# EAGLE design ROM Board 2 (EAGLE 6.6.0)
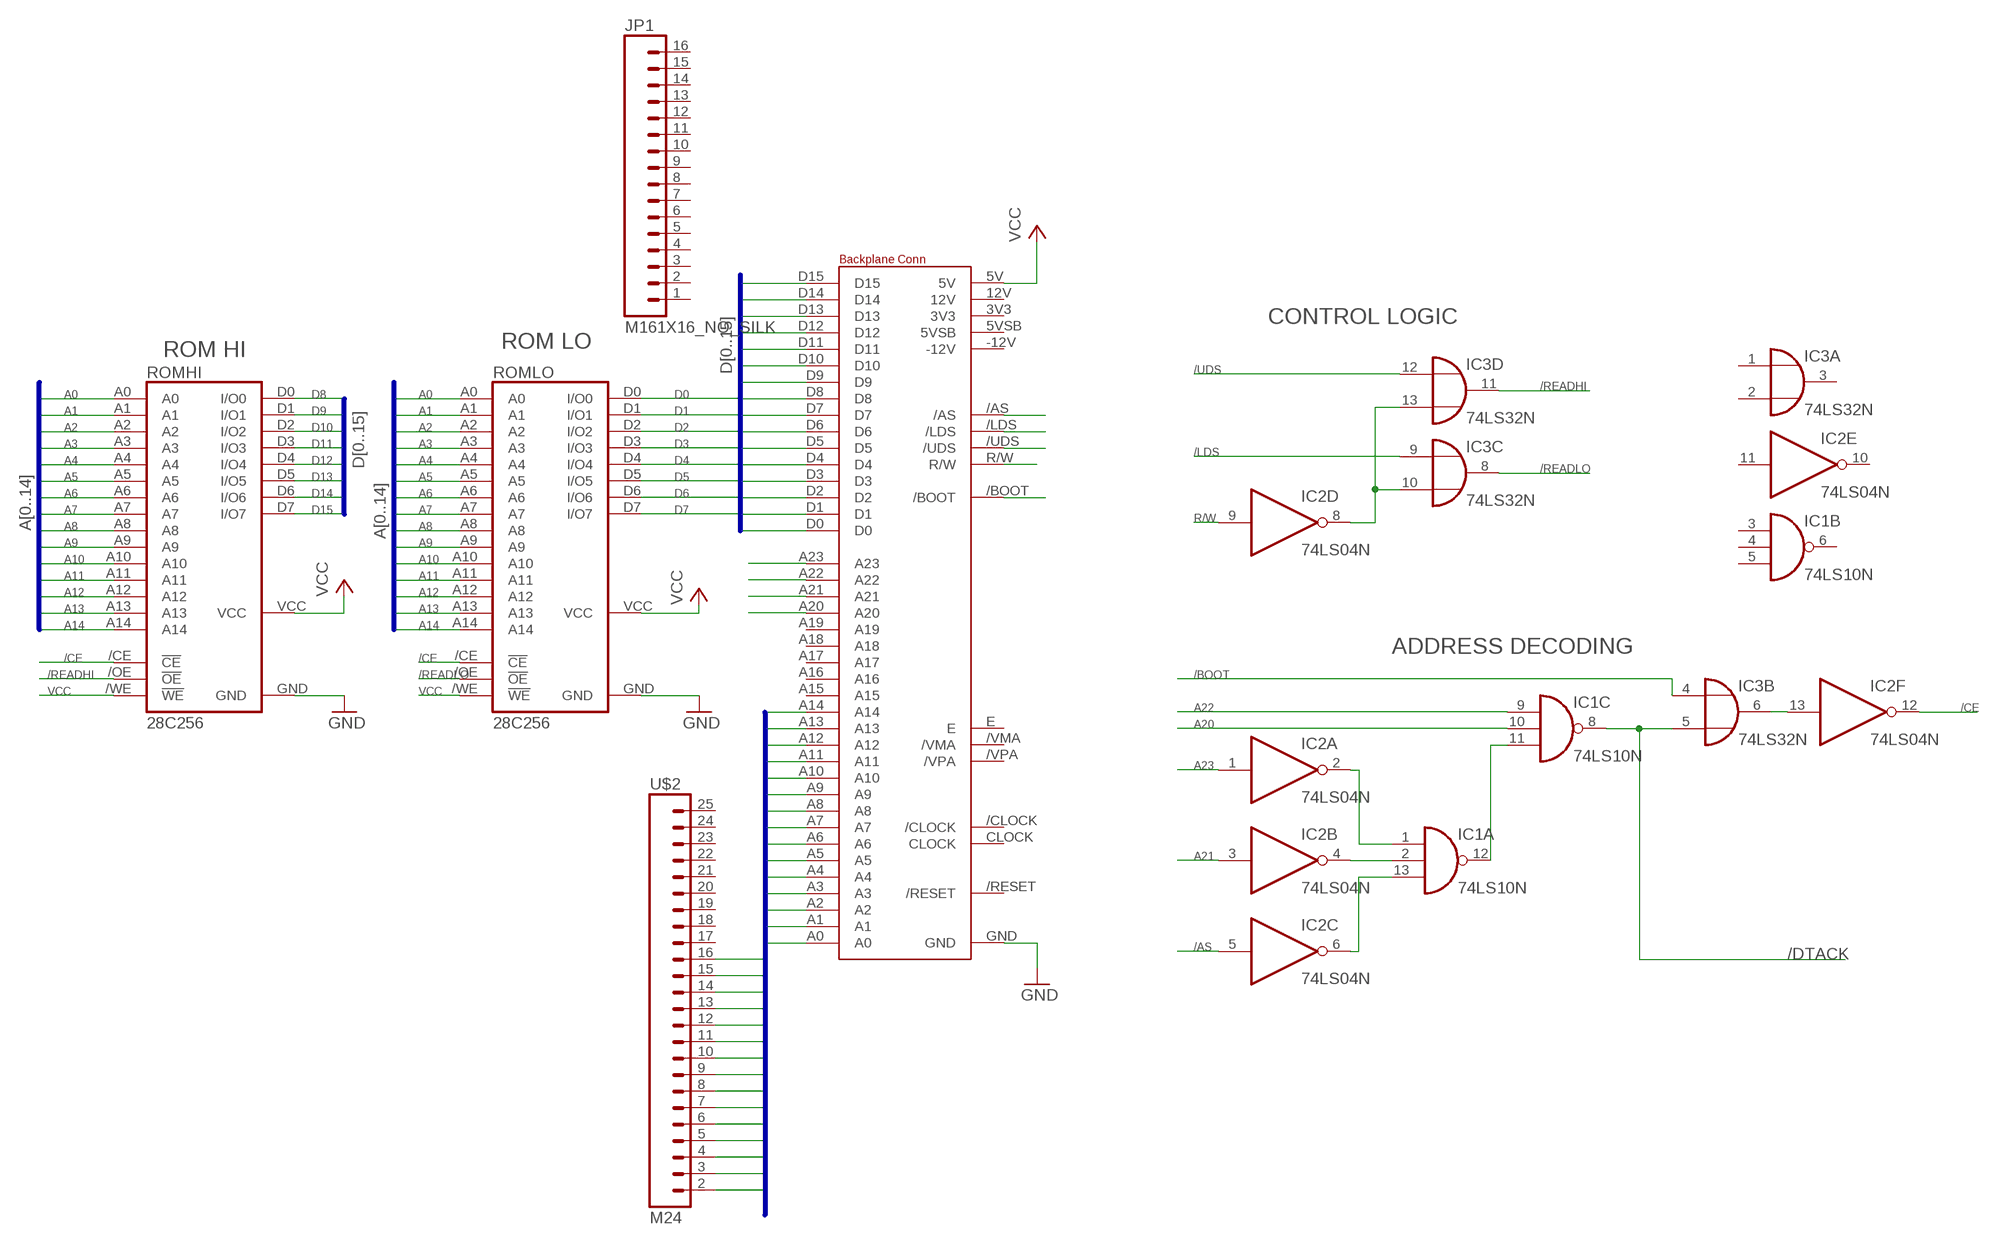
[diagram p0: schematic, sheet 1]

## Parts
IC1  74LS10N  [DIL14]
IC2  74LS04N  [DIL14]
IC3  74LS32N  [DIL14]
JP1  M161X16_NO_SILK  [1X16_NO_SILK]
ROMHI  28C256  [DIL28-6]
ROMLO  28C256  [DIL28-6]
U$1  BACKPLANECONN  [BLANKBOARD]
U$2  M24  [1X24]

## Nets
/AS: IC2.5(C:I) U$1./AS
/BOOT: IC3.4(B:I0) U$1./BOOT
/CE: IC2.12(F:O) ROMHI./CE(!CE) ROMLO./CE(!CE)
/LDS: IC3.9(C:I0) U$1./LDS
/READHI: IC3.11(D:O) ROMHI./OE(!OE)
/READLO: IC3.8(C:O) ROMLO./OE(!OE)
/UDS: IC3.12(D:I0) U$1./UDS
A0: ROMHI.A0 ROMLO.A0 U$1.A0 U$2.2
A1: ROMHI.A1 ROMLO.A1 U$1.A1 U$2.3
A2: ROMHI.A2 ROMLO.A2 U$1.A2 U$2.4
A3: ROMHI.A3 ROMLO.A3 U$1.A3 U$2.5
A4: ROMHI.A4 ROMLO.A4 U$1.A4 U$2.6
A5: ROMHI.A5 ROMLO.A5 U$1.A5 U$2.7
A6: ROMHI.A6 ROMLO.A6 U$1.A6 U$2.8
A7: ROMHI.A7 ROMLO.A7 U$1.A7 U$2.9
A8: ROMHI.A8 ROMLO.A8 U$1.A8 U$2.10
A9: ROMHI.A9 ROMLO.A9 U$1.A9 U$2.11
A10: ROMHI.A10 ROMLO.A10 U$1.A10 U$2.12
A11: ROMHI.A11 ROMLO.A11 U$1.A11 U$2.13
A12: ROMHI.A12 ROMLO.A12 U$1.A12 U$2.14
A13: ROMHI.A13 ROMLO.A13 U$1.A13 U$2.15
A14: ROMHI.A14 ROMLO.A14 U$1.A14 U$2.16
A20: IC1.10(C:I1) U$1.A20
A21: IC2.3(B:I) U$1.A21
A22: IC1.9(C:I0) U$1.A22
A23: IC2.1(A:I) U$1.A23
D0: ROMLO.D0(I/O0) U$1.D0
D1: ROMLO.D1(I/O1) U$1.D1
D2: ROMLO.D2(I/O2) U$1.D2
D3: ROMLO.D3(I/O3) U$1.D3
D4: ROMLO.D4(I/O4) U$1.D4
D5: ROMLO.D5(I/O5) U$1.D5
D6: ROMLO.D6(I/O6) U$1.D6
D7: ROMLO.D7(I/O7) U$1.D7
D8: ROMHI.D0(I/O0) U$1.D8
D9: ROMHI.D1(I/O1) U$1.D9
D10: ROMHI.D2(I/O2) U$1.D10
D11: ROMHI.D3(I/O3) U$1.D11
D12: ROMHI.D4(I/O4) U$1.D12
D13: ROMHI.D5(I/O5) U$1.D13
D14: ROMHI.D6(I/O6) U$1.D14
D15: ROMHI.D7(I/O7) U$1.D15
DECODEOUT: IC1.8(C:O) IC3.5(B:I1)
GND: ROMHI.GND ROMLO.GND U$1.GND
N$1: IC1.1(A:I0) IC2.2(A:O)
N$2: IC1.2(A:I1) IC2.4(B:O)
N$3: IC1.13(A:I2) IC2.6(C:O)
N$4: IC1.11(C:I2) IC1.12(A:O)
N$5: IC2.13(F:I) IC3.6(B:O)
N$6: IC2.8(D:O) IC3.10(C:I1) IC3.13(D:I1)
R/W: IC2.9(D:I) U$1.R/W
VCC: ROMHI./WE(!WE) ROMHI.VCC ROMLO./WE(!WE) ROMLO.VCC U$1.5V
Unconnected: IC1.3(B:I0) IC1.4(B:I1) IC1.5(B:I2) IC1.6(B:O) IC2.10(E:O) IC2.11(E:I) IC3.1(A:I0) IC3.2(A:I1) IC3.3(A:O) JP1.1 JP1.2 JP1.3 JP1.4 JP1.5 JP1.6 JP1.7 JP1.8 JP1.9 JP1.10 JP1.11 JP1.12 JP1.13 JP1.14 JP1.15 JP1.16 U$1.3V3 U$1.5VSB U$1.12V U$1.-12V U$1./CLOCK U$1./RESET U$1./VMA U$1./VPA U$1.A15 U$1.A16 U$1.A17 U$1.A18 U$1.A19 U$1.CLOCK U$1.E U$2.17 U$2.18 U$2.19 U$2.20 U$2.21 U$2.22 U$2.23 U$2.24 U$2.25

## Buses
A[0..14]
D[0..15]

## Notes on the sheet
- CONTROL LOGIC
- ROM LO
- ROM HI
- ADDRESS DECODING
- /DTACK

## Power pins joined to a net without a drawn wire
GND: IC1.7(P:GND) IC2.7(P:GND) IC3.7(P:GND)
VCC: IC1.14(P:VCC) IC2.14(P:VCC) IC3.14(P:VCC)

## Library data of the parts
IC1 = 74xx-eu:74*10: Triple 3-input NAND gate
IC2 = 74xx-eu:74*04: Hex INVERTER
IC3 = 74xx-eu:74*32: Quad 2-input OR gate
JP1 = SparkFun-Connectors:M16: 1x16 .1" header
ROMHI ROMLO = memory-nec:28C256: 28C256 32k x 8 parallel EEPROM
U$1 = Benchoff2:BACKPLANECONN: Backplane Connector
U$2 = SparkFun-Connectors:M24: 1x24 .1" header

## Board
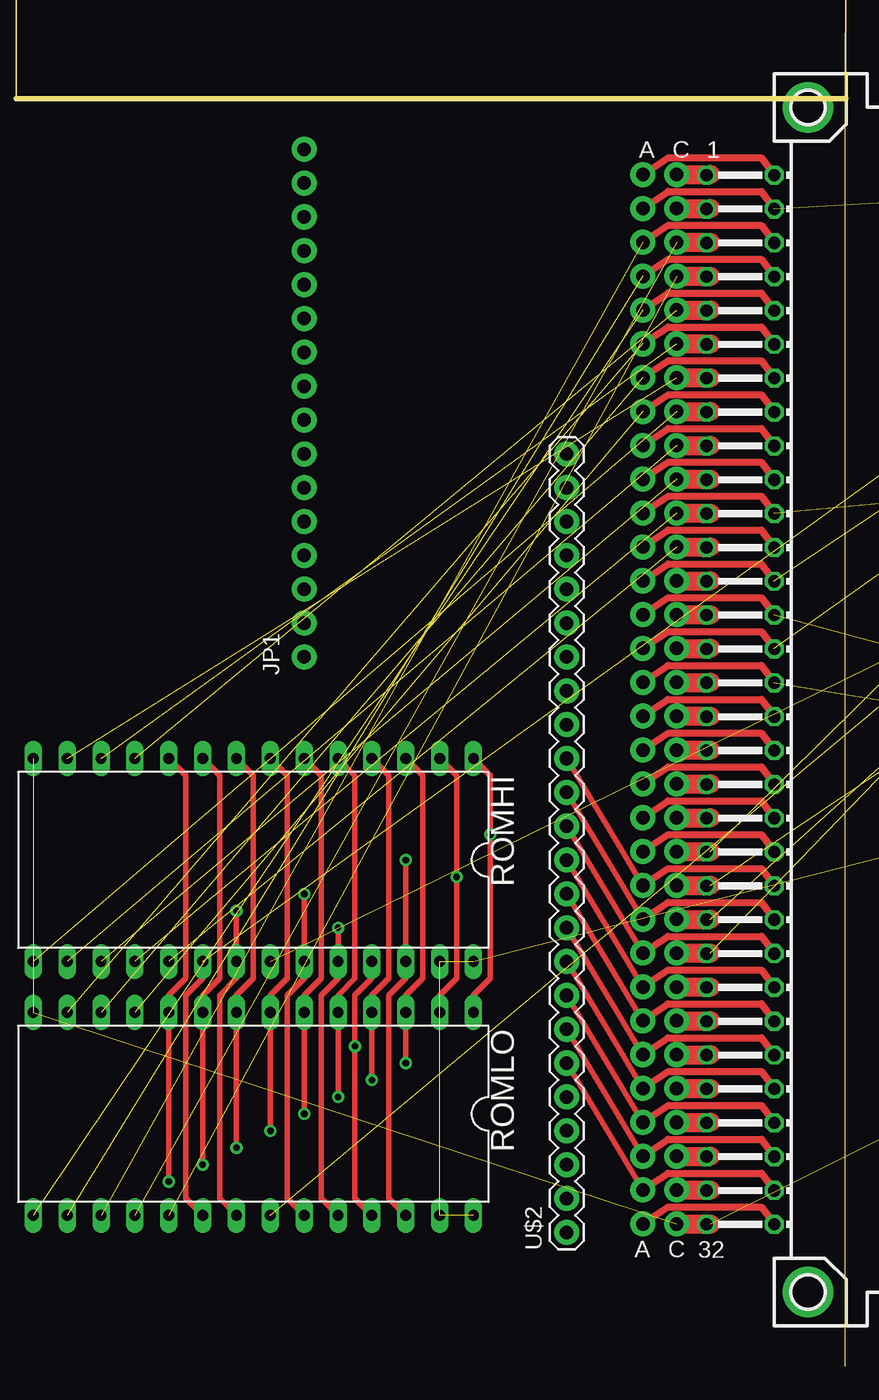
[diagram p1: board, top side]
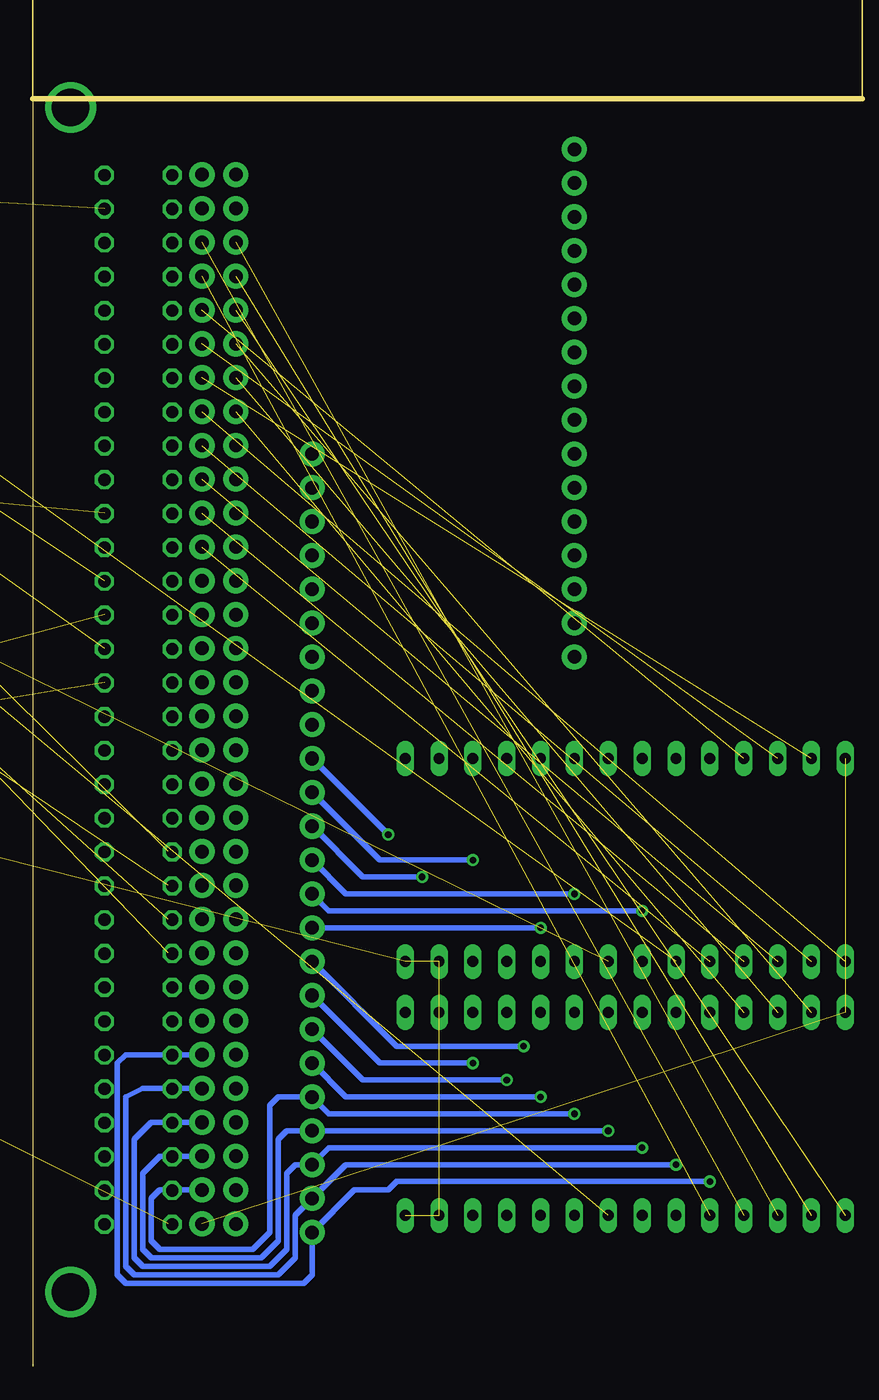
[diagram p2: board, bottom side, seen from below]

Size 0 x 100.03 mm. Coordinates in mm from the lower left corner, seen from the top.
Copper layers (1*16): Top 0.035mm / dielectric 1.5mm / Bottom 0.035mm
Design rules "default": minimum track width 10mil, minimum drill 24mil, track to track 8mil, track to pad 8mil, pad to pad 8mil, via to via 8mil, smd to smd 8mil, copper to edge 40mil, drill to drill 8mil, minimum pad ring 10mil, minimum via ring 8mil, stop-mask expansion 4mil, vias tented up to drill 0mil, thermal gap 10mil
tRestrict: area -86.3,142.1 to -78.7,147.2; area -86.3,154.8 to -78.7,159.9; area -69.8,144.7 to -59.6,157.4; area -52,144.7 to -41.9,157.4; area -34.2,144.7 to -24.1,157.4; area -104.1,142.1 to -96.5,147.2
Milling: area -62.2,103.7 to -60.7,104.3; area -1.5,103.7 to 0,104.3; area -34.5,104.4 to -27.6,106.2; 4 lines

### Footprints (pad centres in the part's own frame; a part is rotated, then mirrored left to right if it is on the bottom)
DIL14 = drill 0.813 long: 1 -7.62,-3.81; 2 -5.08,-3.81; 3 -2.54,-3.81; 4 0,-3.81; 5 2.54,-3.81; 6 5.08,-3.81; 7 7.62,-3.81; 8 7.62,3.81; 9 5.08,3.81; 10 2.54,3.81; 11 0,3.81; 12 -2.54,3.81; 13 -5.08,3.81; 14 -7.62,3.81
1X16_NO_SILK = drill 1.016 pad 1.88: 1 0,0; 2 2.54,0; 3 5.08,0; 4 7.62,0; 5 10.16,0; 6 12.7,0; 7 15.24,0; 8 17.78,0; 9 20.32,0; 10 22.86,0; 11 25.4,0; 12 27.94,0; 13 30.48,0; 14 33.02,0; 15 35.56,0; 16 38.1,0
DIL28-6 = drill 0.813 long: /CE 3.81,7.62; /OE -1.27,7.62; /WE -13.97,7.62; A0 6.35,-7.62; A1 3.81,-7.62; A2 1.27,-7.62; A3 -1.27,-7.62; A4 -3.81,-7.62; A5 -6.35,-7.62; A6 -8.89,-7.62; A7 -11.43,-7.62; A8 -8.89,7.62; A9 -6.35,7.62; A10 1.27,7.62; A11 -3.81,7.62; A12 -13.97,-7.62; A13 -11.43,7.62; A14 -16.51,-7.62; D0 8.89,-7.62; D1 11.43,-7.62; D2 13.97,-7.62; D3 16.51,7.62; D4 13.97,7.62; D5 11.43,7.62; D6 8.89,7.62; D7 6.35,7.62; GND 16.51,-7.62; VCC -16.51,7.62
BLANKBOARD = drill 1.016 pad 1.88: 3V3 -13.97,37.465; 5V -16.51,34.925; 5VSB -13.97,34.925; 12V -16.51,37.465; 26 -13.97,6.985; 28 -13.97,4.445; 30 -13.97,1.905; 32 -13.97,-0.635; 34 -13.97,-3.175; 36 -13.97,-5.715; 40 -13.97,-10.795; -12V -16.51,-41.275; /AS -13.97,-20.955; /BOOT -16.51,12.065; /CLOCK -13.97,-26.035; /LDS -13.97,-18.415; /RESET -13.97,-8.255; /UDS -13.97,-15.875; /VMA -16.51,14.605; /VPA -16.51,9.525; A0 -13.97,-28.575; A1 -13.97,-31.115; A2 -13.97,-33.655; A3 -13.97,-36.195; A4 -13.97,-38.735; A5 -16.51,-38.735; A6 -16.51,-36.195; A7 -16.51,-33.655; A8 -16.51,-31.115; A9 -16.51,-28.575; A10 -16.51,-26.035; A11 -16.51,-23.495; A12 -16.51,-20.955; A13 -16.51,-18.415; A14 -16.51,-15.875; A15 -16.51,-13.335; A16 -16.51,-10.795; A17 -16.51,-8.255; A18 -16.51,-5.715; A19 -16.51,-3.175; A20 -16.51,-0.635; A21 -16.51,1.905; A22 -16.51,4.445; A23 -16.51,6.985; CLOCK -13.97,-23.495; D0 -16.51,19.685; D1 -16.51,22.225; D2 -16.51,24.765; D3 -16.51,27.305; D4 -16.51,29.845; D5 -16.51,32.385; D6 -13.97,32.385; D7 -13.97,29.845; D8 -13.97,27.305; D9 -13.97,24.765; D10 -13.97,22.225; D11 -13.97,19.685; D12 -13.97,17.145; D13 -13.97,14.605; D14 -13.97,12.065; D15 -13.97,9.525; E -16.51,17.145; GND -13.97,-41.275; R/W -13.97,-13.335 | drill 0.914 octagon: F1 -6.651,37.428; F2 -6.651,34.888; F3 -6.651,32.348; F4 -6.651,29.808; F5 -6.651,27.268; F6 -6.651,24.728; F7 -6.651,22.188; F8 -6.651,19.648; F9 -6.651,17.108; F10 -6.651,14.568; F11 -6.651,12.028; F12 -6.651,9.488; F13 -6.651,6.948; F14 -6.651,4.408; F15 -6.651,1.868; F16 -6.651,-0.672; F17 -6.651,-3.212; F18 -6.651,-5.752; F19 -6.651,-8.292; F20 -6.651,-10.832; F21 -6.651,-13.372; F22 -6.651,-15.912; F23 -6.651,-18.452; F24 -6.651,-20.992; F25 -6.651,-23.532; F26 -6.651,-26.072; F27 -6.651,-28.612; F28 -6.651,-31.152; F29 -6.651,-33.692; F30 -6.651,-36.232; F31 -6.651,-38.772; F32 -6.651,-41.312; R1 -11.731,-41.312; R2 -11.731,-38.772; R3 -11.731,-36.232; R4 -11.731,-33.692; R5 -11.731,-31.152; R6 -11.731,-28.612; R7 -11.731,-26.072; R8 -11.731,-23.532; R9 -11.731,-20.992; R10 -11.731,-18.452; R11 -11.731,-15.912; R12 -11.731,-13.372; R13 -11.731,-10.832; R14 -11.731,-8.292; R15 -11.731,-5.752; R16 -11.731,-3.212; R17 -11.731,-0.672; R18 -11.731,1.868; R19 -11.731,4.408; R21 -11.731,9.488; R22 -11.731,12.028; R23 -11.731,14.568; R24 -11.731,17.108; R25 -11.731,19.648; R26 -11.731,22.188; R27 -11.731,24.728; R28 -11.731,27.268; R29 -11.731,29.808; R30 -11.731,32.348; R31 -11.731,34.888; R32 -11.731,37.428; R200 -11.731,6.948 | drill 2.8: P$1 -4.111,42.508; P$2 -4.111,-46.392
1X24 = drill 1.016 pad 1.88: 2 -26.67,0; 3 -24.13,0; 4 -21.59,0; 5 -19.05,0; 6 -16.51,0; 7 -13.97,0; 8 -11.43,0; 9 -8.89,0; 10 -6.35,0; 11 -3.81,0; 12 -1.27,0; 13 1.27,0; 14 3.81,0; 15 6.35,0; 16 8.89,0; 17 11.43,0; 18 13.97,0; 19 16.51,0; 20 19.05,0; 21 21.59,0; 22 24.13,0; 23 26.67,0; 24 29.21,0; 25 31.75,0

### Placement (x,y rotation side)
IC1  34.34,40.52 0 top  (outside the outline)
IC2  35.61,84.97 0 top  (outside the outline)
IC3  38.15,68.46 90 top  (outside the outline)
JP1  -40.59,53.22 90 top  (outside the outline)
ROMHI  -44.4,37.98 180 top  (outside the outline)
ROMLO  -44.4,18.93 180 top  (outside the outline)
U$1  1.32,51.95 0 top
U$2  -20.91,36.71 90 top  (outside the outline)

### Tracks (layer width: path | path; a pad name or v marks a point on that pad's centre or on a via)
/AS  (1 unrouted)
/BOOT  (1 unrouted)
/CE  (1 unrouted)
  Top 0.406: ROMLO./CE -49.48,12.58 -49.48,27.82 -48.21,29.09 ROMHI./CE
/LDS  (1 unrouted)
/READHI  (1 unrouted)
/READLO  (1 unrouted)
/UDS  (1 unrouted)
A0  (via drill 0.5)
  Top 0.406: ROMHI.A0 -49.48,44.33 -49.48,29.09 -50.75,27.82 ROMLO.A0 v-50.75,13.85
  Bottom 0.406: U$1.A0 -6.94,23.38 -6.3,22.74 -6.3,6.87 -6.94,6.23 -20.27,6.23 -20.91,6.87 U$2.2 -24.08,13.22 -26.62,13.22 -27.26,13.85 v-50.75,13.85
A1  (via drill 0.5)
  Top 0.406: ROMHI.A1 -46.94,44.33 -46.94,29.09 -48.21,27.82 ROMLO.A1 v-48.21,15.12
  Bottom 0.406: U$1.A1 -8.21,20.84 -6.94,20.2 -6.94,7.5 -7.57,6.87 -18.37,6.87 -19.64,8.14 -19.64,11.31 U$2.3 -23.45,15.12 v-48.21,15.12
A2  (via drill 0.5)
  Top 0.406: ROMHI.A2 -44.4,44.33 -44.4,29.09 -45.67,27.82 ROMLO.A2 v-45.67,16.39
  Bottom 0.406: U$1.A2 -8.84,18.3 -7.57,17.03 -7.57,8.14 -8.21,7.5 -17.73,7.5 -19,8.77 -19,14.49 -19.64,15.12 U$2.4 -22.18,16.39 v-45.67,16.39
A3  (via drill 0.5)
  Top 0.406: ROMHI.A3 -41.86,44.33 -41.86,29.09 -43.13,27.82 ROMLO.A3 v-43.13,17.66
  Bottom 0.406: U$1.A3 -9.48,15.76 -8.21,14.49 -8.21,8.77 -8.84,8.14 -17.1,8.14 -18.37,9.41 -18.37,17.03 -19,17.66 U$2.5 v-43.13,17.66
A4  (via drill 0.5)
  Top 0.406: ROMHI.A4 -39.32,44.33 -39.32,29.09 -40.59,27.82 ROMLO.A4 v-40.59,18.93
  Bottom 0.406: U$1.A4 -9.48,13.22 -8.84,12.58 -8.84,9.41 -9.48,8.77 -16.46,8.77 -17.73,10.04 -17.73,19.57 -18.37,20.2 U$2.6 -22.18,18.93 v-40.59,18.93
A5  (via drill 0.5)
  Top 0.406: -13.29,14.49 U$1.A5 U$2.7 | ROMHI.A5 -36.78,44.33 -36.78,29.09 -38.05,27.82 ROMLO.A5 v-38.05,20.2
  Bottom 0.406: U$2.7 -23.45,20.2 v-38.05,20.2
A6  (via drill 0.5)
  Top 0.406: -13.29,17.03 U$1.A6 U$2.8 | ROMHI.A6 -34.24,44.33 -34.24,29.09 -35.51,27.82 ROMLO.A6 v-35.51,21.47
  Bottom 0.406: U$2.8 -24.72,21.47 v-35.51,21.47
A7  (via drill 0.5)
  Top 0.406: -13.29,19.57 U$1.A7 U$2.9 | ROMHI.A7 -31.7,44.33 -31.7,29.09 -32.97,27.82 ROMLO.A7 v-32.97,22.74
  Bottom 0.406: U$2.9 -25.99,22.74 v-32.97,22.74
A8  (via drill 0.5)
  Top 0.406: -13.29,22.11 U$1.A8 U$2.10 | ROMLO.A8 -36.78,12.58 v-36.78,24.01 -36.78,25.28 -36.78,27.82 -35.51,29.09 ROMHI.A8
  Bottom 0.406: U$2.10 -27.26,24.01 v-36.78,24.01
A9  (via drill 0.5)
  Top 0.406: ROMLO.A9 -39.32,12.58 -39.32,27.82 -38.05,29.09 ROMHI.A9 v-38.05,32.9 | U$2.11 U$1.A9
  Bottom 0.406: U$2.11 v-38.05,32.9
A10  (via drill 0.5)
  Top 0.406: ROMLO.A10 -46.94,12.58 -46.94,27.82 -45.67,29.09 ROMHI.A10 v-45.67,34.17 | U$2.12 U$1.A10
  Bottom 0.406: U$2.12 -22.18,34.17 v-45.67,34.17
A11  (via drill 0.5)
  Top 0.406: ROMLO.A11 -41.86,12.58 -41.86,27.82 -40.59,29.09 ROMHI.A11 v-40.59,35.44 | U$2.13 U$1.A11
  Bottom 0.406: U$2.13 -23.45,35.44 v-40.59,35.44
A12  (via drill 0.5)
  Top 0.406: ROMLO.A12 -30.43,27.82 -29.16,29.09 v-29.16,36.71 -29.16,37.98 -29.16,44.33 ROMHI.A12 | U$2.14 U$1.A12
  Bottom 0.406: U$2.14 -24.72,36.71 v-29.16,36.71
A13  (via drill 0.5)
  Top 0.406: ROMLO.A13 -34.24,12.58 -34.24,27.82 -32.97,29.09 ROMHI.A13 v-32.97,37.98 | U$2.15 U$1.A13
  Bottom 0.406: U$2.15 -25.99,37.98 v-32.97,37.98
A14  (via drill 0.5)
  Top 0.406: U$2.16 U$1.A14 | ROMLO.A14 -27.89,27.82 -26.62,29.09 v-26.62,39.89 -26.62,41.16 -26.62,44.33 ROMHI.A14
  Bottom 0.406: U$2.16 v-26.62,39.89
A20  (1 unrouted)
A21  (1 unrouted)
A22  (1 unrouted)
A23  (1 unrouted)
D0  (1 unrouted)
D1  (1 unrouted)
D2  (1 unrouted)
D3  (1 unrouted)
D4  (1 unrouted)
D5  (1 unrouted)
D6  (1 unrouted)
D7  (1 unrouted)
D8  (1 unrouted)
D9  (1 unrouted)
D10  (1 unrouted)
D11  (1 unrouted)
D12  (1 unrouted)
D13  (1 unrouted)
D14  (1 unrouted)
D15  (1 unrouted)
DECODEOUT  (1 unrouted)
GND  (5 unrouted)
N$1  (1 unrouted)
N$2  (1 unrouted)
N$3  (1 unrouted)
N$4  (1 unrouted)
N$5  (1 unrouted)
N$6  (2 unrouted)
R/W  (1 unrouted)
VCC  (7 unrouted)